# Altium schematic sheet 2_comp_stage.SchDoc
size A4; SheetNumber: 3; SheetTotal: 6
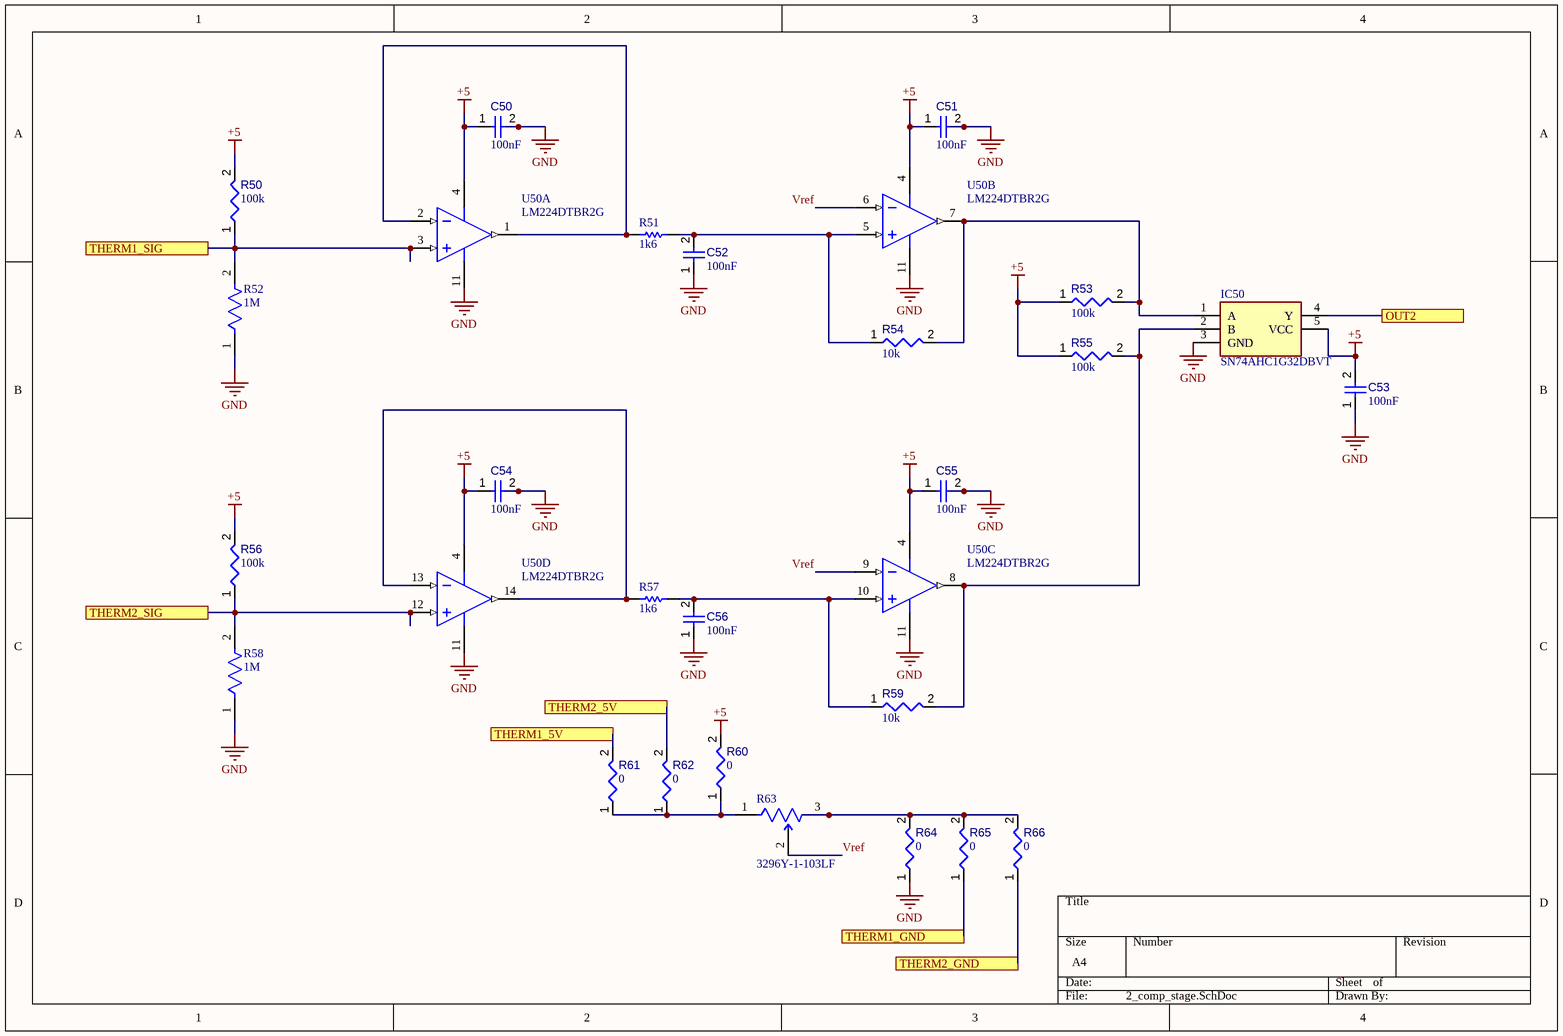
[diagram p0: 2_comp_stage.SchDoc]

## Parts
C50  value 100nF  [CAPC1608X90X40NL10T20]  (hidden comment: Capacitor 100 nF +/-10% 50 V 0603)
C51  value 100nF  [CAPC1608X90X40NL10T20]  (hidden comment: Capacitor 100 nF +/-10% 50 V 0603)
C52  value 100nF  [CAPC1608X90X40NL10T20]  (hidden comment: Capacitor 100 nF +/-10% 50 V 0603)
C53  value 100nF  [CAPC1608X90X40NL10T20]  (hidden comment: Capacitor 100 nF +/-10% 50 V 0603)
C54  value 100nF  [CAPC1608X90X40NL10T20]  (hidden comment: Capacitor 100 nF +/-10% 50 V 0603)
C55  value 100nF  [CAPC1608X90X40NL10T20]  (hidden comment: Capacitor 100 nF +/-10% 50 V 0603)
C56  value 100nF  [CAPC1608X90X40NL10T20]  (hidden comment: Capacitor 100 nF +/-10% 50 V 0603)
IC50  SN74AHC1G32DBVT  [SOT95P280X145-5N]
R50  value 100k  [RESC1608X55X25ML10T15]  (hidden comment: Resistor 100k +/-1% 0603 100 mW)
R51  1k6  [RESC1609X50X30LL10T20]
R52  1M  [FP-RMCF0603-IPC_B]
R53  value 100k  [RESC1608X55X25ML10T15]  (hidden comment: Resistor 100k +/-1% 0603 100 mW)
R54  value 10k  [RESC1608X55X25ML10T15]  (hidden comment: Resistor 10k +/-1% 0603 100 mW)
R55  value 100k  [RESC1608X55X25ML10T15]  (hidden comment: Resistor 100k +/-1% 0603 100 mW)
R56  value 100k  [RESC1608X55X25ML10T15]  (hidden comment: Resistor 100k +/-1% 0603 100 mW)
R57  1k6  [RESC1609X50X30LL10T20]
R58  1M  [FP-RMCF0603-IPC_B]
R59  value 10k  [RESC1608X55X25ML10T15]  (hidden comment: Resistor 10k +/-1% 0603 100 mW)
R60  value 0  [RESC0603(1608)_L]  (hidden comment: 0R3J)
R61  value 0  [RESC0603(1608)_L]  (hidden comment: 0R3J)
R62  value 0  [RESC0603(1608)_L]  (hidden comment: 0R3J)
R63  3296Y-1-103LF  [FP-3296Y-MFG]
R64  value 0  [RESC0603(1608)_L]  (hidden comment: 0R3J)
R65  value 0  [RESC0603(1608)_L]  (hidden comment: 0R3J)
R66  value 0  [RESC0603(1608)_L]  (hidden comment: 0R3J)
U50  LM224DTBR2G  [ONSC-TSSOP-14-948G-01_V]  (parts A,B,C,D of 4)

## Ports
OUT2, THERM1_5V, THERM1_GND, THERM1_SIG, THERM2_5V, THERM2_GND, THERM2_SIG

## Nets
+5: C50.1 C51.1 C53.2 C54.1 C55.1 IC50.5(VCC) R50.2 R53.1 R55.1 R56.2 R60.2 U50.4(VCC)
GND: C50.2 C51.2 C52.1 C53.1 C54.2 C55.2 C56.1 IC50.3(GND) R52.1 R58.1 R64.1 U50.11(VEE/GND)
OUT2: IC50.4(Y) ; port OUT2
THERM1_5V: R61.2 ; port THERM1_5V
THERM1_GND: R65.1 ; port THERM1_GND
THERM1_SIG: R50.1 R52.2 U50.3(IN1+) ; port THERM1_SIG
THERM2_5V: R62.2 ; port THERM2_5V
THERM2_GND: R66.1 ; port THERM2_GND
THERM2_SIG: R56.1 R58.2 U50.12(IN4+) ; port THERM2_SIG
Vref: R63.2(WIPER) U50.6(IN2-) U50.9(IN3-)
NetC52_2: C52.2 R51.2 R54.1 U50.5(IN2+)
NetC56_2: C56.2 R57.2 R59.1 U50.10(IN3+)
NetIC50_1: IC50.1(A) R53.2 R54.2 U50.7(OUT2)
NetIC50_2: IC50.2(B) R55.2 R59.2 U50.8(OUT3)
NetR51_1: R51.1 U50.1(OUT1) U50.2(IN1-)
NetR57_1: R57.1 U50.13(IN4-) U50.14(OUT4)
NetR60_1: R60.1 R61.1 R62.1 R63.1(CCW)
NetR63_3: R63.3(CW) R64.2 R65.2 R66.2

## Library data of the parts
C50-C56 = CMP-001-00017-6: Chip Capacitor, 100 nF, +/- 10%, 50 V, 0603 (1608 Metric); Voltage Rating: 50V; Capacitor Type: Ceramic; Tolerance: 10%; Mounting Technology: SM; Max Operating Temperature: 125°C; RoHS Compliant: True; Pins: 2; Case/Package: 0603; Min Operating Temperature: -55°C
IC50 = SN74AHC1G32DBVT: Integrated Circuit; Manufacturer_Name: Texas Instruments; Datasheet Link: http://www.ti.com/general/docs/lit/getliterature.tsp?genericPartNumber=sn74ahc1g32&fileType=pdf; Height: 1.45mm; Manufacturer_Part_Number: SN74AHC1G32DBVT; Mouser Part Number: 595-SN74AHC1G32DBVT; Mouser Price/Stock: https://www.mouser.co.uk/ProductDetail/Texas-Instruments/SN74AHC1G32DBVT?qs=fSCvMSq5ISVX4j%2FpWgAWfA%3D%3D; Arrow Part Number: SN74AHC1G32DBVT; Arrow Price/Stock: https://www.arrow.com/en/products/sn74ahc1g32dbvt/texas-instruments?region=nac
R50 R53 R55 R56 = CMP-009-00023-5: Chip Resistor, 100 KOhm, +/- 1%, 0.1 W, -55 to 155 degC, 0603 (1608 Metric); Voltage Rating: 50V; Power: 100mW; Max Operating Temperature: 155°C; RoHS Compliant: True; Tolerance: 1%; Pins: 2; Case/Package: 0603; Mounting Technology: SM; Min Operating Temperature: -55°C
R51 R57 = CMP-2000-03000-1: Part Number: CRCW06031K60FKEA; Manufacturer: Vishay Dale
R52 R58 = CMP-26527-006958-1: 1MΩ ±1% 0.1W 0603 Thick Film Chip Resistor AEC-Q200 compliant; Resistance: 1MR; Working Voltage: 75V; Temperature Coefficient: 100ppm/°C; Power Rating: 100mW; Series: RMCF; Case/Package: 0603; Packaging: Tape and Reel; Technology: THICK FILM; Depth: 0.8mm; Contact Plating: Tin; Lead Free: Lead Free; Mount: Surface Mount; Features: Automotive AEC-Q200; Construction: Rectangular; Length: 1.55mm; Tolerance: 1%; Resistor Type: Thick Film; Max Power Dissipation: 100mW; Case Code (Imperial): 0603; Height: 0.022inch; Max Operating Temperature: 155°C; Radiation Hardening: No; Width: 0.031inch; Min Operating Temperature: -55°C; Military Standard: Not; Number of Terminations: 2; Case Code (Metric): 1608; RoHS Compliant: Yes
R54 R59 = CMP-009-00017-5: Chip Resistor, 10 KOhm, +/- 1%, 01 W, -55 to 155 degC, 0603 (1608 Metric); Voltage Rating: 50V; Power: 100mW; RoHS Compliant: True; Min Operating Temperature: -55°C; Pins: 2; Case/Package: 0603; Mounting Technology: SM; Max Operating Temperature: 155°C; Tolerance: 1%
R60-R62 R64-R66 = CMP-009-00063-2: Jumper 0603 (1608 Metric); Case/Package: 0603; Mounting Technology: SMT; Pins: 2
R63 = CMP-07234-000015-2: TRIMMER 10K OHM 0.5W PC PIN TOP; Manufacturer Series: 3296; Resistance: 10kR; Actuator Orientation: Vertical; Power Rating: 500mW; Temperature Coefficient: 100ppm/°C; Resistance Tolerance: 10%; Resistance Law: Linear; Number of Turns: 25; Actuator Type: SCREW; Number of Terminals/Pins: 3; Insulation Resistance: 1GR; Military Standard: Not; REACH SVHC: No SVHC; Lead Free: Lead Free; Resistor Type: Cermet; Max Operating Temperature: 125°C; Radiation Hardening: No; Package Quantity: 50; Mount: Panel; Max Power Dissipation: 500mW; Min Operating Temperature: -55°C; Type: Potentiometer; Terminal Finish: Tin; Termination: Pin; Taper: Linear; Color: Blue; Technology: CERMET; Packaging: Rail/Tube; Weight: 0.03oz; Height: 0.395inch; Number of Pins: 3; RoHS Compliant: Yes; Width: 9.53mm; Tolerance: 10%; Depth: 4.83mm; Series: 3296; Length: 9.53mm
U50 = CMP-1310-00430-1: Single Supply Quad Operational Amplifier, 3 to 32 V, -25 to 85 degC, 14-Pin TSSOP, Pb-Free, Tape and Reel; Manufacturer: On Semiconductor; VCC Min (V): 3; VCC Max (V): 32; Mounting Technology: Surface Mount; PackageVersion: Rev. B, 10/2006; DatasheetVersion: Rev. 25; RoHS: TRUE; ComponentLink3URL: http://www.onsemi.com/pub_link/Collateral/948G-01.PDF; ComponentLink3Description: Package Specification; PackageDescription: 14-Pin Small Outline Package, Body 5 x 4.4 mm, Pitch 0.65 mm; PackageReference: TSSOP-14-948G-01; ComponentLink1URL: http://www.onsemi.com/; Packing: Tape and Reel; ComponentLink2Description: Datasheet; PartNumber: LM224DTBR2G; ComponentLink2URL: http://www.onsemi.cn/pub_link/Collateral/LM324-D.PDF; ComponentLink1Description: Manufacturer URL